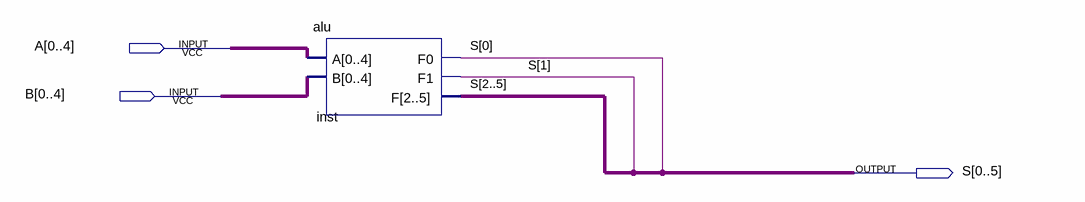
[diagram p0: schematic sheet]
// Quartus schematic PrincipalAdder.bdf as structural Verilog: 1 symbols, 3 pins
module PrincipalAdder (
  input  [0:4] A,
  input  [0:4] B,
  output [0:5] S
);

  alu inst (.A(A), .B(B), .F0(S[0]), .F1(S[1]), .F(S[2:5]));
endmodule
